# Altium schematic sheet BQ34z100pwr.SchDoc
size A4; SheetNumber: 2; SheetTotal: 4
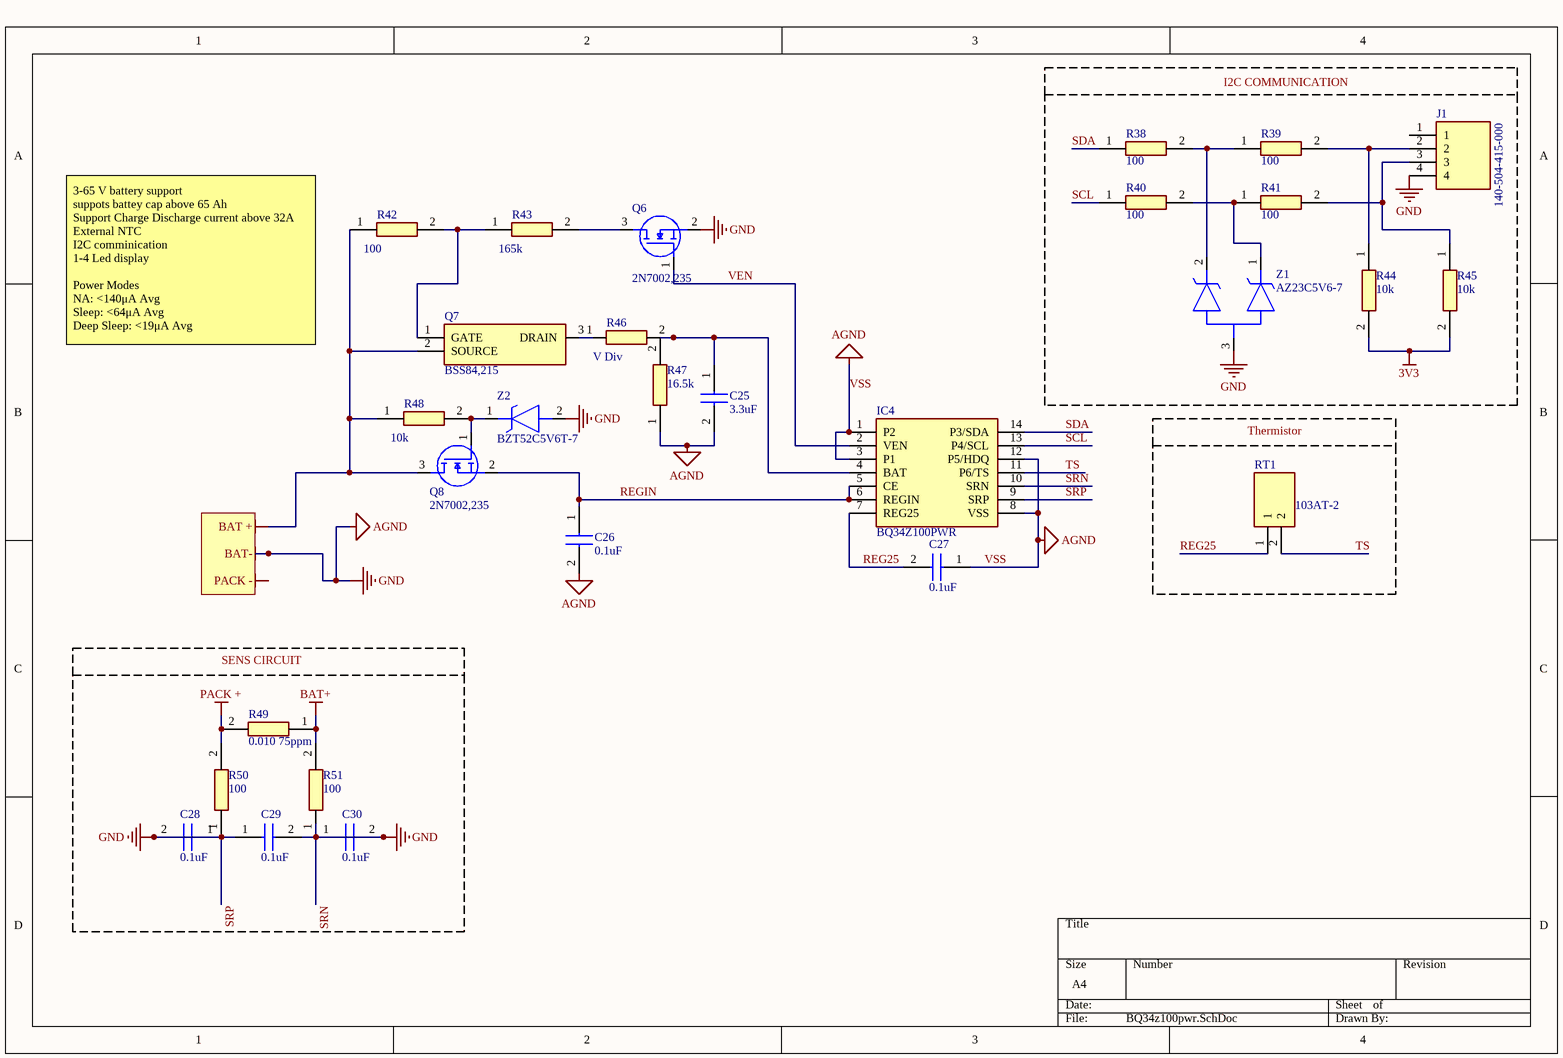
[diagram p0: BQ34z100pwr.SchDoc]

## Parts
C25  3.3uF  [CAPC1608X90N]
C26  0.1uF  [CAPC1608X90N]
C27  0.1uF  [CAPC1608X90N]
C28  0.1uF  [CAPC1608X90N]
C29  0.1uF  [CAPC1608X90N]
C30  0.1uF  [CAPC1608X90N]
IC4  BQ34Z100PWR  [SOP65P640X120-14N]
J1  140-504-415-000  [140504415000]
Q6  2N7002,235  [SOT95P230X110-3N]
Q7  BSS84,215  [SOT95P230X110-3N]
Q8  2N7002,235  [SOT95P230X110-3N]
R38  100  [RESC1608X55N]
R39  100  [RESC1608X55N]
R40  100  [RESC1608X55N]
R41  100  [RESC1608X55N]
R42  100  [RESC1608X55N]
R43  165k  [RESC1608X55N]
R44  10k  [RESC1608X55N]
R45  10k  [RESC1608X55N]
R46  V Div  [RESC1608X55N]
R47  16.5k  [RESC1608X55N]
R48  10k  [RESC1608X55N]
R49  0.010 75ppm  [RESC1608X55N]
R50  100  [RESC1608X55N]
R51  100  [RESC1608X55N]
RT1  103AT-2  [103AT2]
Z1  AZ23C5V6-7  [SOT96P240X110-3N]
Z2  BZT52C5V6T-7  [SODFL1608X65N]

## Blocks framed on the sheet
I2C COMMUNICATION: J1 R38-R41 R44 R45 Z1
Thermistor: RT1
SENS CIRCUIT: C28-C30 R49-R51

## Nets
3V3: R44.2 R45.2
BAT +: Q7.2(SOURCE) Q8.3(D) R42.1 R48.1
BAT+: R49.1 R51.2
PACK +: R49.2 R50.2
SRN: C25.2 C26.2 C27.1 C28.1 C28.2 C29.1 C29.2 C30.1 C30.2 IC4.1(P2) IC4.3(P1) IC4.8(VSS) IC4.9(SRP) IC4.10(SRN) IC4.12(P5/HDQ) J1.4 Q6.2(S) R47.1 R50.1 R51.1 Z1.3(COMMON_ANODE) Z2.2(A)  [also labelled AGND, BAT-, GND, SRP, VSS]
REG25: C27.2 IC4.7(REG25) RT1.1
REGIN: C26.1 IC4.5(CE) IC4.6(REGIN) Q8.2(S)
SCL: IC4.13(P4/SCL) R40.1
SDA: IC4.14(P3/SDA) R38.1
TS: IC4.11(P6/TS) RT1.2
VEN: IC4.2(VEN) Q6.1(G)
NetC25_1: C25.1 IC4.4(BAT) R46.2 R47.2
NetJ1_2: J1.2 R39.2 R44.1
NetJ1_3: J1.3 R41.2 R45.1
NetQ6_3: Q6.3(D) R43.2
NetQ7_1: Q7.1(GATE) R42.2 R43.1
NetQ7_3: Q7.3(DRAIN) R46.1
NetQ8_1: Q8.1(G) R48.2 Z2.1(K)
NetR38_2: R38.2 R39.1 Z1.2(CATHODE_2)
NetR40_2: R40.2 R41.1 Z1.1(CATHODE_1)

Not connected (* = marked no-connect by the designer): J1 1

## Notes on the sheet
- 3-65 V battery support
  suppots battey cap above 65 Ah
  Support Charge Discharge current above 32A
  External NTC
  I2C comminication
  1-4 Led display
  Power Modes
  NA: <140μA Avg
  Sleep: <64μA Avg
  Deep Sleep: <19μA Avg
- Labels drawn without touching a wire or pin: PACK -

## Library data of the parts
C25-C30 = EMK107B7104KAHT: Capacitor; Manufacturer_Name: TAIYO YUDEN; Datasheet Link: https://componentsearchengine.com/Datasheets/2/EMK107B7104KAHT.pdf; Height: 0.9mm; Manufacturer_Part_Number: EMK107B7104KAHT; Mouser Part Number: 963-EMK107B7104KAHT; Mouser Price/Stock: https://www.mouser.co.uk/ProductDetail/Taiyo-Yuden/EMK107B7104KAHT?qs=Va%252BXcMGJzEvYcymJV6GEGg%3D%3D
IC4 = BQ34Z100PWR: Integrated Circuit; Manufacturer_Name: Texas Instruments; Datasheet Link: https://www.ti.com/lit/ds/symlink/bq34z100.pdf?HQS=dis-dk-null-digikeymode-dsf-pf-null-wwe&ts=1639563438358&ref_url=https%253A%252F%252Fwww.ti.com%252Fgeneral%252Fdocs%252Fsuppproductinfo.tsp%253FdistId%253D10%2526gotoUrl%253Dhttps%253A%252F%252Fwww.ti.co; Height: 1.2mm; Manufacturer_Part_Number: BQ34Z100PWR; Mouser Part Number: 595-BQ34Z100PWR; Mouser Price/Stock: https://www.mouser.co.uk/ProductDetail/Texas-Instruments/BQ34Z100PWR?qs=Zv8nmyeoaKtU157avFmCXg%3D%3D; Arrow Part Number: BQ34Z100PWR; Arrow Price/Stock: https://www.arrow.com/en/products/bq34z100pwr/texas-instruments
J1 = 140-504-415-000: Connector; Manufacturer_Name: EDAC; Datasheet Link: https://files.edac.net/edac/content/140/140-504-415-000%20-%20EDAC%20E-MATE%20(Pin%20Header)%20Connector.PDF; Height: 5.25mm; Manufacturer_Part_Number: 140-504-415-000; Mouser Part Number: 587-140-504-415-000; Mouser Price/Stock: https://www.mouser.co.uk/ProductDetail/EDAC/140-504-415-000?qs=zW32dvEIR3t2whP8kwSMKQ%3D%3D
Q6 Q8 = 2N7002,235: MOSFET (N-Channel); Manufacturer_Name: Nexperia; Datasheet Link: https://assets.nexperia.com/documents/data-sheet/2N7002.pdf; Height: 1.1mm; Manufacturer_Part_Number: 2N7002,235; Mouser Part Number: 771-2N7002235; Mouser Price/Stock: https://www.mouser.co.uk/ProductDetail/Nexperia/2N7002235?qs=AX3SRYwdf7Gv59FeQZ%2FkYw%3D%3D; Arrow Part Number: 2N7002,235; Arrow Price/Stock: https://www.arrow.com/en/products/2n7002235/nexperia
Q7 = BSS84,215: Transistor; Manufacturer_Name: Nexperia; Datasheet Link: https://componentsearchengine.com/Datasheets/2/BSS84,215.pdf; Height: 1.1mm; Manufacturer_Part_Number: BSS84,215; Mouser Part Number: 771-BSS84-T/R; Mouser Price/Stock: https://www.mouser.co.uk/ProductDetail/Nexperia/BSS84215?qs=me8TqzrmIYUAnPU0lBnsXg%3D%3D; Arrow Part Number: BSS84,215; Arrow Price/Stock: https://www.arrow.com/en/products/bss84215/nexperia?region=nac
R38-R51 = CR0603-FX-1003ELF: Resistor; Manufacturer_Name: Bourns; Datasheet Link: https://www.bourns.com/pdfs/chpreztr.pdf; Height: 0.55mm; Manufacturer_Part_Number: CR0603-FX-1003ELF; Mouser Part Number: 652-CR0603-FX-103ELF; Mouser Price/Stock: https://www.mouser.co.uk/ProductDetail/Bourns/CR0603-FX-1003ELF?qs=K5ddiUFZPT49r0RoKWcKqg%3D%3D; Arrow Part Number: CR0603-FX-1003ELF; Arrow Price/Stock: https://www.arrow.com/en/products/cr0603-fx-1003elf/bourns?region=europe
RT1 = 103AT-2: Thermistor; Manufacturer_Name: Semitec; Datasheet Link: https://datasheet.datasheetarchive.com/originals/distributors/Datasheets-30/DSA-588185.pdf; Height: 8mm; Manufacturer_Part_Number: 103AT-2; Mouser Part Number: 954-103AT-2; Mouser Price/Stock: https://www.mouser.co.uk/ProductDetail/Semitec/103AT-2?qs=wgO0AD0o1vvcDzsKguD%252Bew%3D%3D
Z1 = AZ23C5V6-7: Zener Diode; Manufacturer_Name: Diodes Inc.; Datasheet Link: https://www.diodes.com/assets/Datasheets/ds18003.pdf; Height: 1.1mm; Manufacturer_Part_Number: AZ23C5V6-7; Mouser Part Number: 621-AZ23C5V6; Mouser Price/Stock: https://www.mouser.co.uk/ProductDetail/Diodes-Incorporated/AZ23C5V6-7?qs=SSucg2PyLi7liuy0Pq8%2FiA%3D%3D
Z2 = BZT52C5V6T-7: Zener Diode; Manufacturer_Name: Diodes Inc.; Datasheet Link: https://www.mouser.com/datasheet/2/115/ds30502-1142513.pdf; Height: 0.65mm; Manufacturer_Part_Number: BZT52C5V6T-7; Mouser Part Number: 621-BZT52C5V6T-7; Mouser Price/Stock: https://www.mouser.co.uk/ProductDetail/Diodes-Incorporated/BZT52C5V6T-7?qs=zLeapIUCO8Tm%252BIuaCPAdkQ%3D%3D; Arrow Part Number: BZT52C5V6T-7; Arrow Price/Stock: https://www.arrow.com/en/products/bzt52c5v6t-7/diodes-incorporated?region=nac